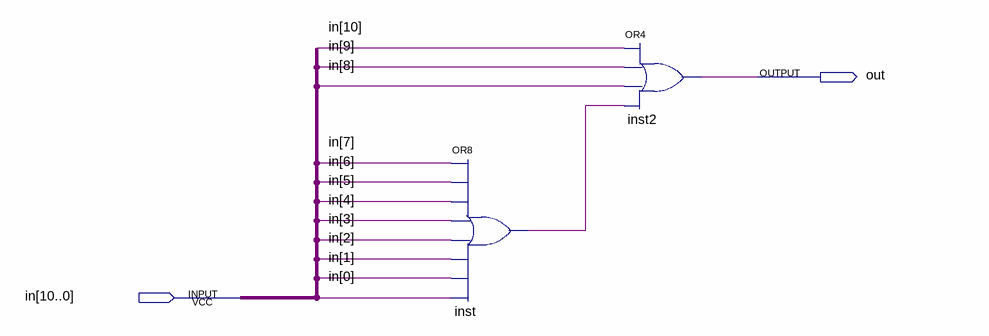
[diagram p0: schematic sheet]
// Quartus schematic OR11.bdf as structural Verilog: 2 symbols, 2 pins
module OR11 (
  input  [10:0] in,
  output out
);

  wire inst_out;

  or inst (inst_out, in[7], in[6], in[5], in[4], in[3], in[2], in[1], in[0]);
  or inst2 (out, in[10], in[9], in[8], inst_out);
endmodule
